# EAGLE design CONVEYOR-v2_0 (EAGLE 9.7.0)

## Sheet 1 of 2
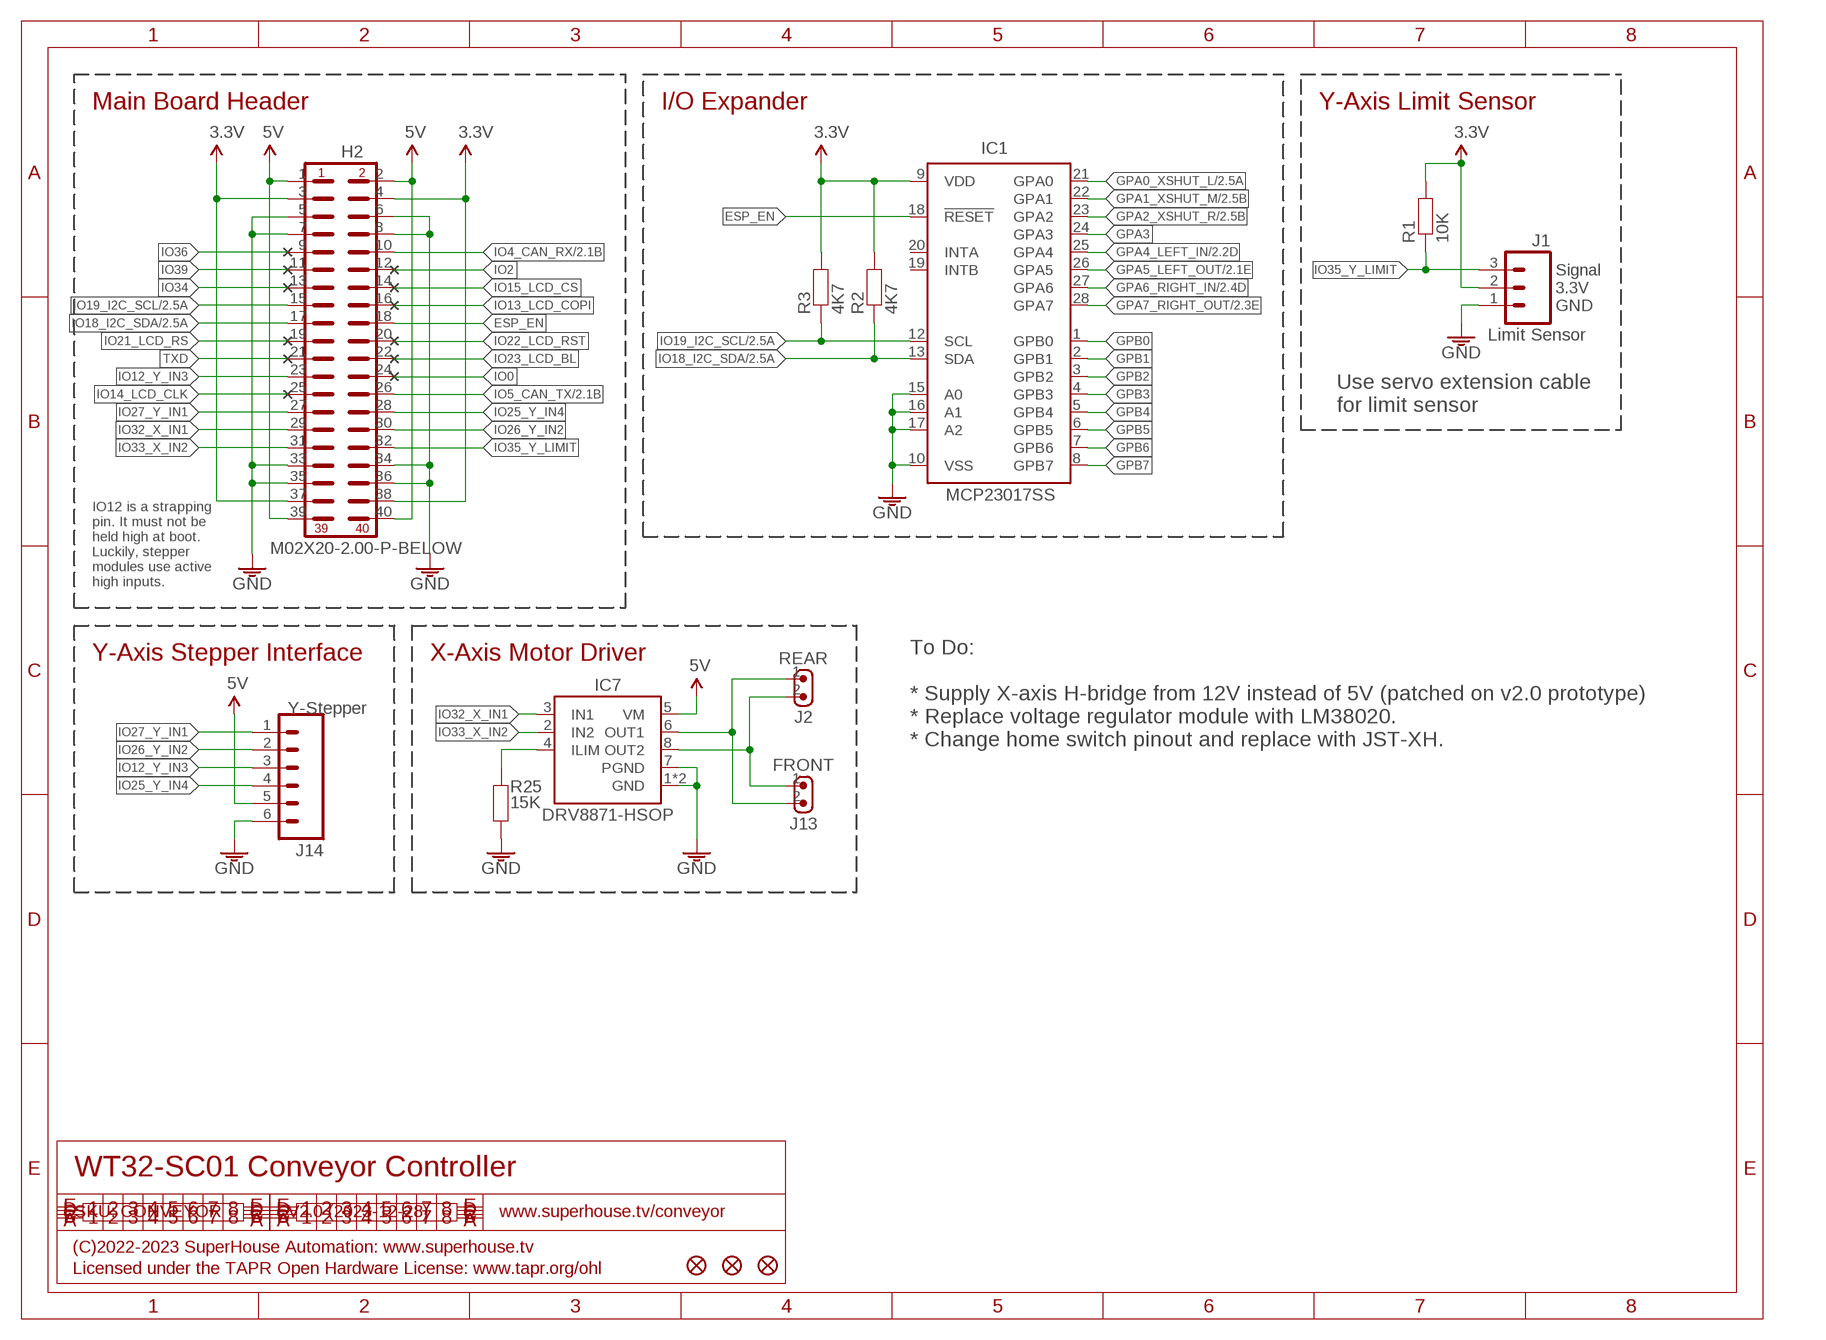
[diagram p0: schematic, sheet 1]

### Parts
H2  M02X20-2.00-P-BELOW  [2X20-2.00-P-BELOW]
IC1  MCP23017SS  [SSOP28]
IC7  DRV8871-HSOP  [SOIC8T]
J1  Limit Sensor  M03-PIN  [1X03-P]
J2  REAR  M02-B2B-XH  [JST-B2B-XH-A]
J13  FRONT  M02-B2B-XH  [JST-B2B-XH-A]
J14  Y-Stepper  M06-B6B-XH  [JST-B6B-XH-A]
R1  10K  RESISTOR0603  [R0603]
R2  4K7  RESISTOR0603  [R0603]
R3  4K7  RESISTOR0603  [R0603]
R25  15K  RESISTOR0603  [R0603]
U$4  FIDUCIAL1X2.5  [FIDUCIAL-1X2.5]
U$5  FIDUCIAL1X2.5  [FIDUCIAL-1X2.5]
U$6  FIDUCIAL1X2.5  [FIDUCIAL-1X2.5]

### Nets
3.3V: H2.3 H2.4 H2.37 H2.38 IC1.9(VDD) J1.2 R1.2 R2.2 R3.2 ; also sheet 2
5V: H2.1 H2.2 H2.39 H2.40 IC7.5(VM) J14.5 ; also sheet 2
ESP_EN: H2.18 IC1.18(!RESET)
GND: H2.5 H2.6 H2.7 H2.8 H2.33 H2.34 H2.35 H2.36 IC1.10(VSS) IC1.15(A0) IC1.16(A1) IC1.17(A2) IC7.1(GND) IC7.7(PGND) IC7.TGND(GND) J1.1 J14.6 R25.1 ; also sheet 2
GPA0_XSHUT_L: IC1.21(GPA0) ; also sheet 2
GPA1_XSHUT_M: IC1.22(GPA1) ; also sheet 2
GPA2_XSHUT_R: IC1.23(GPA2) ; also sheet 2
GPA3: IC1.24(GPA3)
GPA4_LEFT_IN: IC1.25(GPA4) ; also sheet 2
GPA5_LEFT_OUT: IC1.26(GPA5) ; also sheet 2
GPA6_RIGHT_IN: IC1.27(GPA6) ; also sheet 2
GPA7_RIGHT_OUT: IC1.28(GPA7) ; also sheet 2
GPB0: IC1.1(GPB0)
GPB1: IC1.2(GPB1)
GPB2: IC1.3(GPB2)
GPB3: IC1.4(GPB3)
GPB4: IC1.5(GPB4)
GPB5: IC1.6(GPB5)
GPB6: IC1.7(GPB6)
GPB7: IC1.8(GPB7)
IO0: H2.24
IO2: H2.12
IO4_CAN_RX: H2.10 ; also sheet 2
IO5_CAN_TX: H2.26 ; also sheet 2
IO12_Y_IN3: H2.23 J14.3
IO13_LCD_COPI: H2.16
IO14_LCD_CLK: H2.25
IO15_LCD_CS: H2.14
IO18_I2C_SDA: H2.17 IC1.13(SDA) R2.1 ; also sheet 2
IO19_I2C_SCL: H2.15 IC1.12(SCL) R3.1 ; also sheet 2
IO21_LCD_RS: H2.19
IO22_LCD_RST: H2.20
IO23_LCD_BL: H2.22
IO25_Y_IN4: H2.28 J14.4
IO26_Y_IN2: H2.30 J14.2
IO27_Y_IN1: H2.27 J14.1
IO32_X_IN1: H2.29 IC7.3(IN1)
IO33_X_IN2: H2.31 IC7.2(IN2)
IO34: H2.13
IO35_Y_LIMIT: H2.32 J1.3 R1.1
IO36: H2.9
IO39: H2.11
N$1: IC7.4(ILIM) R25.2
N$4: IC7.6(OUT1) J2.1 J13.2
N$5: IC7.8(OUT2) J2.2 J13.1
TXD: H2.21
Unconnected: IC1.19(INTB) IC1.20(INTA)

### Notes on the sheet
- Main Board Header | I/O Expander | Y-Axis Limit Sensor
- Signal
- 3.3V
- GND
- Use servo extension cable
  for limit sensor
- IO12 is a strapping
  pin. It must not be
  held high at boot.
  Luckily, stepper
  modules use active
  high inputs.
- Y-Axis Stepper Interface | X-Axis Motor Driver
- To Do:
  
  * Supply X-axis H-bridge from 12V instead of 5V (patched on v2.0 prototype)
  * Replace voltage regulator module with LM38020.
  * Change home switch pinout and replace with JST-XH.
- WT32-SC01 Conveyor Controller
- SKU: CONVEYOR | V2.0 (2023-12-28) | www.superhouse.tv/conveyor
- (C)2022-2023 SuperHouse Automation: www.superhouse.tv
- Licensed under the TAPR Open Hardware License: www.tapr.org/ohl

## Sheet 2 of 2
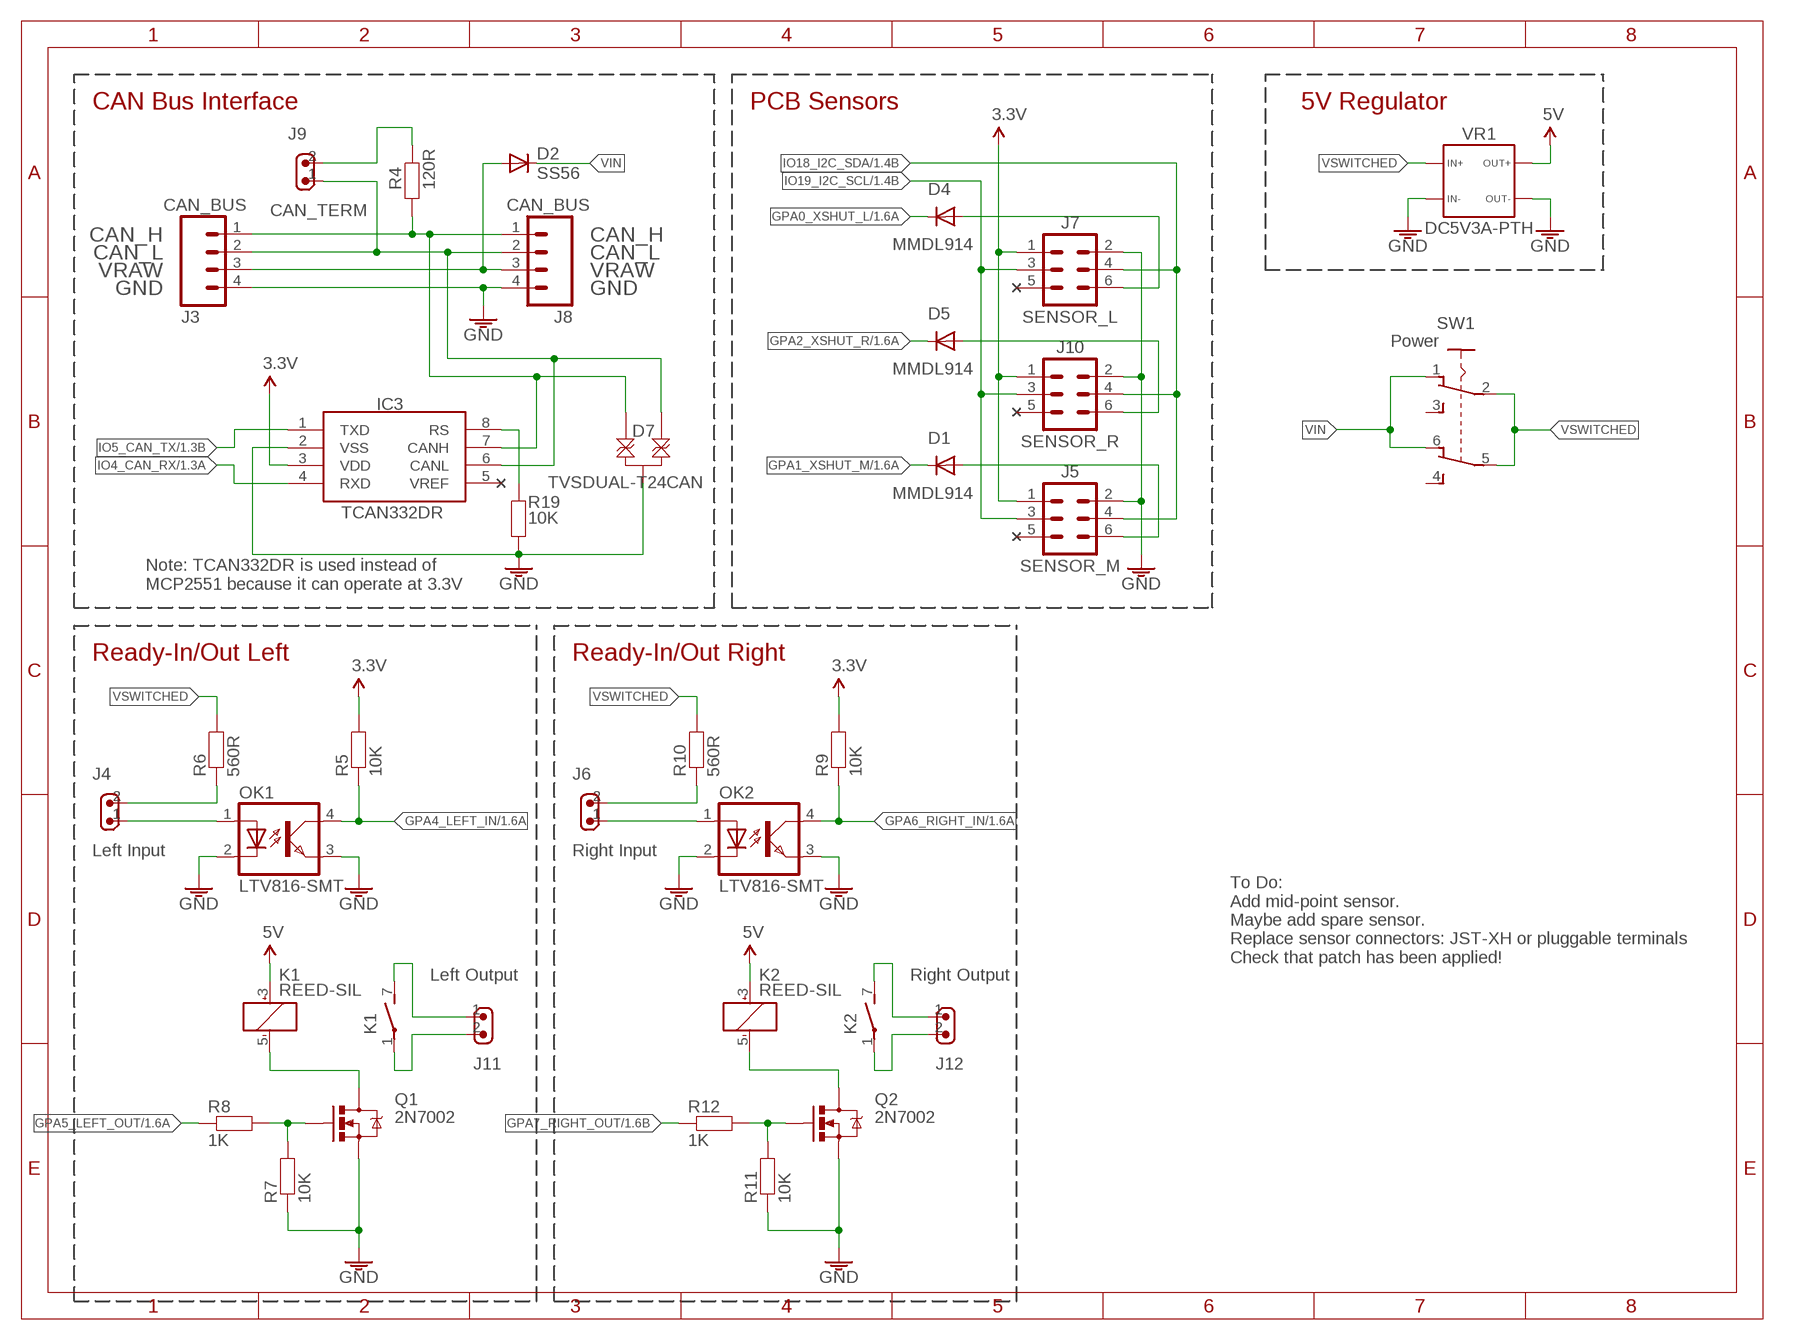
[diagram p1: schematic, sheet 2]

### Parts
D1  MMDL914  DIODESOD  [SOD-323]
D2  SS56  DIODESMA  [SMA-DIODE]
D4  MMDL914  DIODESOD  [SOD-323]
D5  MMDL914  DIODESOD  [SOD-323]
D7  TVSDUAL-T24CAN  [SOT23-3]
IC3  TCAN332DR  MCP2551  [SO08]
J3  CAN_BUS  M04-SCREW-3.81MM-VERT-PLUG  [SCREWTERMINAL-3.81MM-VERT-4]
J4  Left Input  M02-KF2510  [1X02-KF2510]
J5  SENSOR_M  M02X3-SHROUDED  [2X3-2.54-SHROUDED]
J6  Right Input  M02-KF2510  [1X02-KF2510]
J7  SENSOR_L  M02X3-SHROUDED  [2X3-2.54-SHROUDED]
J8  CAN_BUS  M04-SCREW-3.81MM-VERT-PLUG  [SCREWTERMINAL-3.81MM-VERT-4]
J9  CAN_TERM  M02-PIN-JUMP-Y  [1X02-P-JUMP-Y]
J10  SENSOR_R  M02X3-SHROUDED  [2X3-2.54-SHROUDED]
J11  Left Output  M02-KF2510  [1X02-KF2510]
J12  Right Output  M02-KF2510  [1X02-KF2510]
K1  REED-SIL  [REED]
K2  REED-SIL  [REED]
OK1  LTV816-SMT  [SMD4]
OK2  LTV816-SMT  [SMD4]
Q1  2N7002  MOSFET-NCHANNEL-233  [SOT23-3]
Q2  2N7002  MOSFET-NCHANNEL-233  [SOT23-3]
R4  120R  RESISTOR2010  [R2010]
R5  10K  RESISTOR0603  [R0603]
R6  560R  RESISTOR0603  [R0603]
R7  10K  RESISTOR0603  [R0603]
R8  1K  RESISTOR0603  [R0603]
R9  10K  RESISTOR0603  [R0603]
R10  560R  RESISTOR0603  [R0603]
R11  10K  RESISTOR0603  [R0603]
R12  1K  RESISTOR0603  [R0603]
R19  10K  RESISTOR0603  [R0603]
SW1  Power  SWITCH-DPDT3  [7201SD9AV2BE]
VR1  DC5V3A-PTH  [DC5V3A-PTH]

### Nets
3.3V: IC3.3(VDD) J5.1 J7.1 J10.1 R5.2 R9.2 ; also sheet 1
5V: K1.3(1:+) K2.3(1:+) VR1.3A VR1.3B ; also sheet 1
CAN_H1: D7.2 IC3.7(CANH) J3.1 J8.1 R4.1
CAN_L1: D7.1 IC3.6(CANL) J3.2 J8.2 J9.1
CAN_VIN: D2.A J3.3 J8.3
GND: D7.3 IC3.2(VSS) J3.4 J5.2 J7.2 J8.4 J10.2 OK1.2(C) OK1.3(EMIT) OK2.2(C) OK2.3(EMIT) Q1.2(S) Q2.2(S) R7.1 R11.1 R19.1 VR1.1A VR1.1B VR1.4A VR1.4B ; also sheet 1
GPA0_XSHUT_L: D4.1(C) ; also sheet 1
GPA1_XSHUT_M: D1.1(C) ; also sheet 1
GPA2_XSHUT_R: D5.1(C) ; also sheet 1
GPA4_LEFT_IN: OK1.4(COL) R5.1 ; also sheet 1
GPA5_LEFT_OUT: R8.1 ; also sheet 1
GPA6_RIGHT_IN: OK2.4(COL) R9.1 ; also sheet 1
GPA7_RIGHT_OUT: R12.1 ; also sheet 1
IO4_CAN_RX: IC3.4(RXD) ; also sheet 1
IO5_CAN_TX: IC3.1(TXD) ; also sheet 1
IO18_I2C_SDA: J5.4 J7.4 J10.4 ; also sheet 1
IO19_I2C_SCL: J5.3 J7.3 J10.3 ; also sheet 1
N$2: IC3.8(RS) R19.2
N$3: D1.2(A) J5.6
N$20: J9.2 R4.2
N$22: D5.2(A) J10.6
N$24: J4.1 OK1.1(A)
N$26: J4.2 R6.1
N$27: D4.2(A) J7.6
N$28: K1.5(1:-) Q1.3(D)
N$31: J11.2 K1.1(2:P)
N$32: Q1.1(G) R7.2 R8.2
N$34: J11.1 K1.7(2:S)
N$36: Q2.1(G) R11.2 R12.2
N$38: K2.5(1:-) Q2.3(D)
N$40: J12.2 K2.1(2:P)
N$41: J12.1 K2.7(2:S)
N$42: J6.1 OK2.1(A)
N$43: J6.2 R10.1
VIN: D2.C SW1.1 SW1.6
VSWITCHED: R6.2 R10.2 SW1.2 SW1.5 VR1.2A VR1.2B
Unconnected: IC3.5(VREF) J5.5 J7.5 J10.5 SW1.3 SW1.4

### Notes on the sheet
- CAN Bus Interface | PCB Sensors | 5V Regulator
- CAN_H | CAN_H
- CAN_L | CAN_L
- VRAW | VRAW
- GND | GND
- Note: TCAN332DR is used instead of
  MCP2551 because it can operate at 3.3V
- Ready-In/Out Left | Ready-In/Out Right
- To Do:
  Add mid-point sensor.
  Maybe add spare sensor.
  Replace sensor connectors: JST-XH or pluggable terminals
  Check that patch has been applied!

## Library data of the parts
D1 D2 D4 D5 = SuperHouse-Diodes:DIODE: Diode Standard reverse protection diodes and small signal diodes. SMA package can handle up to about 1A. SOD-323 can handle about 200mA.
D7 = SuperHouse-Diodes:TVSDUAL: Transient Voltage Suppressor (dual)
H2 = SuperHouse-Connectors:M02X20: M40 header in 2x20 format
IC1 = SuperHouse-ICs:MCP23017: http://ww1.microchip.com/downloads/en/DeviceDoc/21952a.pdf Source: http://ww1.microchip.com/downloads/en/DeviceDoc/21952a.pdf
IC3 = SuperHouse-ICs:MCP2551: CAN bus transceiver. Pin compatible chips with different specs include: MCP2551 (5V only) TCAN332DR (3.3V)
IC7 = SuperHouse-MotorDrivers:DRV8871: TI DRV8871 3.6A brushed DC motor driver
J1 = SuperHouse-Connectors:M03: 3-way header Standard 1x3 header, and screw terminal variations
J2 J4 J6 J9 J11-J13 = SuperHouse-Connectors:M02: 2-way header Standard 1x2 header, and screw terminal variations
J3 J8 = SuperHouse-Connectors:M04: 4-way header Standard 1x4 header, and screw terminal variations
J5 J7 J10 = SuperHouse-Connectors:M02X3: M6 header in 2x3 format
J14 = SuperHouse-Connectors:M06: 6-way header Standard 1x6 header, and screw terminal variations
K1 K2 = SuperHouse-Relays:REED: RELAY reed, 1 x norm. open with polarity, grid 5.08
OK1 OK2 = SuperHouse-LEDs:LTV816: OPTO COUPLER Source: LITEON, LTV816.pdf; OC_FARNELL: unknown; OC_NEWARK: unknown
Q1 Q2 = SuperHouse-Transistors:MOSFET-NCHANNEL: N-channel MOSFET
R1-R12 R19 R25 = SuperHouse-Resistors:RESISTOR: Resistors in both surface-mount and through-hole versions.
SW1 = SuperHouse-Switches:SWITCH-DPDT: DPDT toggle switch
U$4-U$6 = SuperHouse-Symbols:FIDUCIAL: Fiducial Alignment Points Various fiducial points for machine vision alignment.
VR1 = SuperHouse-Regulators:DC5V3A: 5V 3A voltage regulator module from AliExpress

## Board
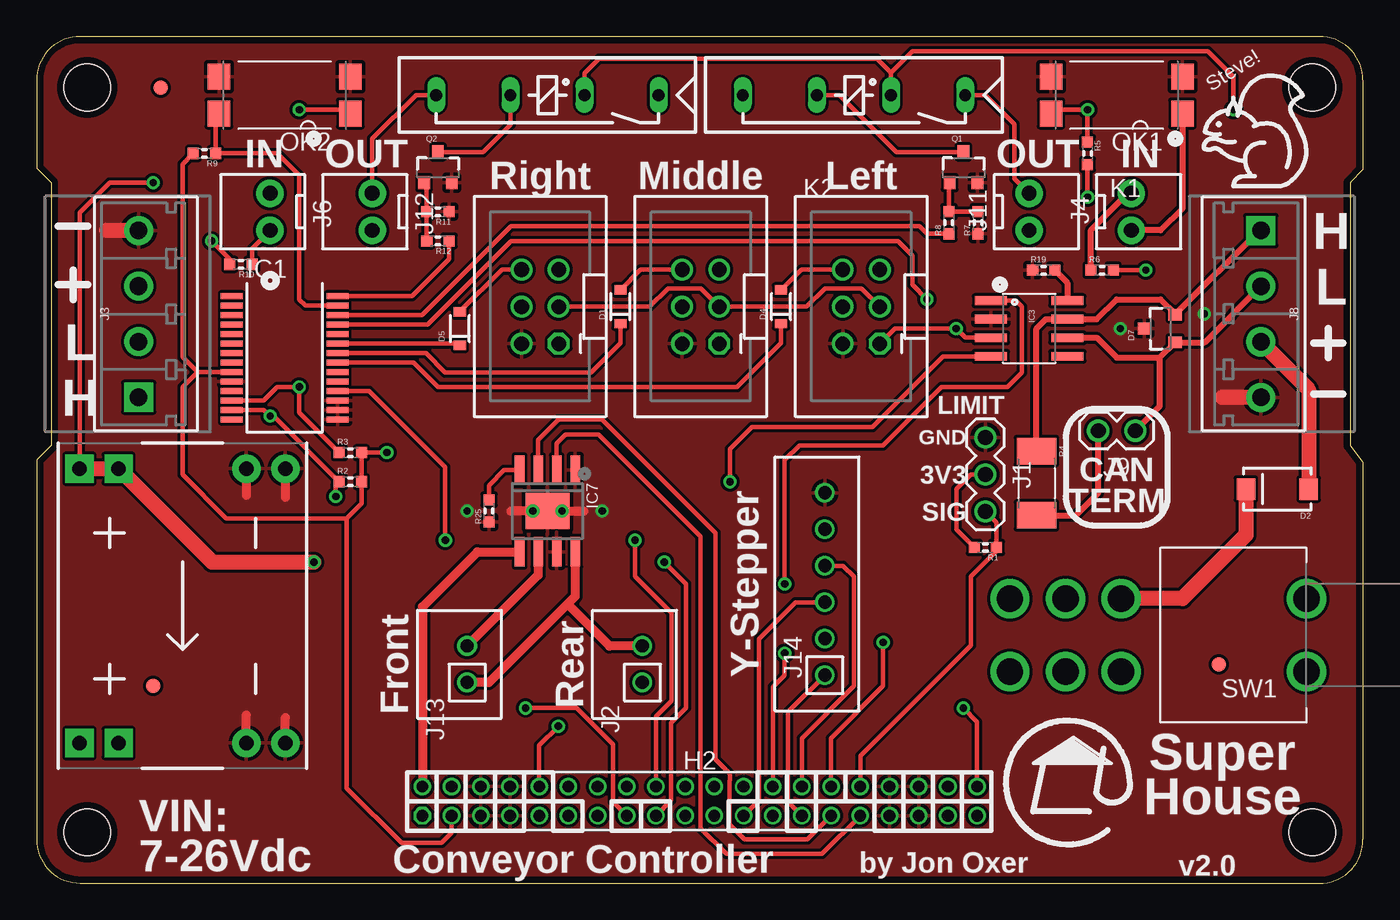
[diagram p2: board, top side]
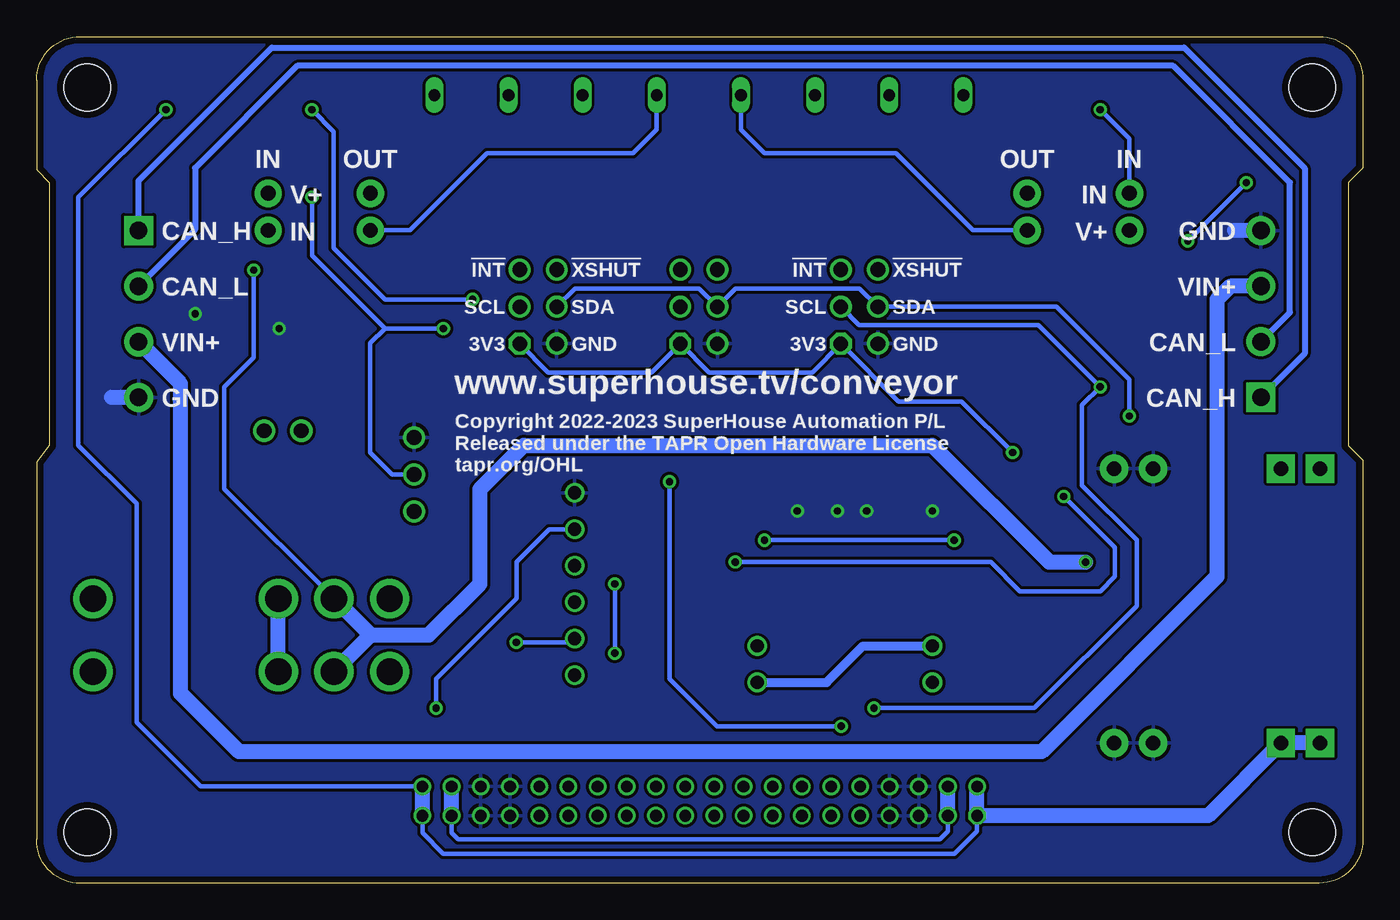
[diagram p3: board, bottom side, seen from below]

Size 90.87 x 58.01 mm. Coordinates in mm from the lower left corner, seen from the top.
Outline: 87.87,58.01 3,58.01 arc90 0,55.01 0,49 1,48 1,30 0,29 0,3 arc90 3,0 87.87,0 arc92 90.87,3 90.87,28.87 90,30 90,48 90.87,48.87 90.87,55.01 arc90 87.87,58.01
Copper layers (1*16): Top 0.035mm / dielectric 1.5mm / Bottom 0.035mm
Design rules "SuperHouse-Design-Rules *": minimum track width 10mil, minimum drill 24mil, track to track 8mil, track to pad 8mil, pad to pad 8mil, via to via 8mil, smd to smd 6mil, copper to edge 18mil, drill to drill 8mil, minimum pad ring 7mil, minimum via ring 8mil, stop-mask expansion 4mil, vias tented up to drill 0.5mm, thermal gap 10mil
Holes 3.2 mm at 3.47,54.52 3.47,3.49 87.4,54.52 87.4,3.49

### Footprints (pad centres in the part's own frame; a part is rotated, then mirrored left to right if it is on the bottom)
SOD-323 = smd 0.63 x 0.83: 1 -1.15,0; 2 1.15,0
SMA-DIODE = smd 1.27 x 1.47: A -2.15,0; C 2.15,0
SOT23-3 = smd 0.8 x 0.9: 1 -0.95,-1; 2 0.95,-1; 3 0,1.1
2X20-2.00-P-BELOW = drill 0.8 octagon: 1 -19,-1 | drill 0.8: 2 -19,1; 3 -17,-1; 4 -17,1; 5 -15,-1; 6 -15,1; 7 -13,-1; 8 -13,1; 9 -11,-1; 10 -11,1; 11 -9,-1; 12 -9,1; 13 -7,-1; 14 -7,1; 15 -5,-1; 16 -5,1; 17 -3,-1; 18 -3,1; 19 -1,-1; 20 -1,1; 21 1,-1; 22 1,1; 23 3,-1; 24 3,1; 25 5,-1; 26 5,1; 27 7,-1; 28 7,1; 29 9,-1; 30 9,1; 31 11,-1; 32 11,1; 33 13,-1; 34 13,1; 35 15,-1; 36 15,1; 37 17,-1; 38 17,1; 39 19,-1; 40 19,1
SSOP28 = smd 0.4 x 1.5: 1 -4.225,-3.625; 2 -3.575,-3.625; 3 -2.925,-3.625; 4 -2.275,-3.625; 5 -1.625,-3.625; 6 -0.975,-3.625; 7 -0.325,-3.625; 8 0.325,-3.625; 9 0.975,-3.625; 10 1.625,-3.625; 11 2.275,-3.625; 12 2.925,-3.625; 13 3.575,-3.625; 14 4.225,-3.625; 15 4.225,3.625; 16 3.575,3.625; 17 2.925,3.625; 18 2.275,3.625; 19 1.625,3.625; 20 0.975,3.625; 21 0.325,3.625; 22 -0.325,3.625; 23 -0.975,3.625; 24 -1.625,3.625; 25 -2.275,3.625; 26 -2.925,3.625; 27 -3.575,3.625; 28 -4.225,3.625
SO08 = smd 0.61 x 2.21: 1 -1.905,-2.616; 2 -0.635,-2.616; 3 0.635,-2.616; 4 1.905,-2.616; 5 1.905,2.616; 6 0.635,2.616; 7 -0.635,2.616; 8 -1.905,2.616
SOIC8T = smd 2.032 x 0.66: 1 -2.794,1.905; 2 -2.794,0.635; 3 -2.794,-0.635; 4 -2.794,-1.905; 5 2.794,-1.905; 6 2.794,-0.635; 7 2.794,0.635; 8 2.794,1.905 | smd 2.489 x 2.997: TGND 0,0
1X03-P = drill 1.016: 1 -2.54,0; 2 0,0; 3 2.54,0
JST-B2B-XH-A = drill 0.9: 1 -1.25,0; 2 1.25,0
SCREWTERMINAL-3.81MM-VERT-4 = drill 1.2 pad 2 square: 1 -5.715,0 | drill 1.2 pad 2: 2 -1.902,0; 3 1.908,0; 4 5.718,0
1X02-KF2510 = drill 1.016 pad 1.88: 1 -1.27,0; 2 1.27,0
2X3-2.54-SHROUDED = drill 1 octagon: 1 -2.54,-1.27 | drill 1: 2 -2.54,1.27; 3 0,-1.27; 4 0,1.27; 5 2.54,-1.27; 6 2.54,1.27
1X02-P-JUMP-Y = drill 1.016: 1 -1.27,0; 2 1.27,0
JST-B6B-XH-A = drill 0.9: 1 -6.25,0; 2 -3.75,0; 3 -1.25,0; 4 1.25,0; 5 3.75,0; 6 6.25,0
REED = drill 0.813 long: 1 -7.62,0; 3 -2.54,0; 5 2.54,0; 7 7.62,0
SMD4 = smd 1.78 x 1.55: 1 -1.27,-4.5; 2 1.27,-4.5; 3 1.27,4.5; 4 -1.27,4.5
R0603 = smd 0.762 x 0.762: 1 -0.762,0; 2 0.762,0
R2010 = smd 1.8 x 2.7: 1 -2.2,0; 2 2.2,0
7201SD9AV2BE = drill 1.8: 1 12.7,-2.5; 2 16.51,-2.5; 3 20.32,-2.5; 4 20.32,2.5; 5 16.51,2.5; 6 12.7,2.5; 7 0,2.5; 8 0,-2.5
FIDUCIAL-1X2.5 = smd 1 x 1: 1 0,0
DC5V3A-PTH = drill 1 pad 1.93: 1A -9.4,7.05; 1B -9.4,4.375; 4A 9.4,7.05; 4B 9.4,4.375 | drill 1 pad 1.93 square: 2A -9.4,-4.375; 2B -9.4,-7.05; 3A 9.4,-4.375; 3B 9.4,-7.05

### Placement (x,y rotation side)
D1  40,39.5 90 top
D2  85,27 180 top
D4  51,39.5 90 top
D5  29,38 90 top
D7  77,38 90 top
H2  45.44,5.62 0 top
IC1  17,36 270 top
IC3  68,38 270 top
IC7  35,25.5 270 top
J1  65,28 270 top
J2  41.5,15 90 top
J3  7,39 90 top
J4  75,46 90 top
J5  45.5,39.5 90 top
J6  16,46 270 top
J7  56.5,39.5 90 top
J8  83.87,39 270 top
J9  74,31 180 top
J10  34.5,39.5 90 top
J11  68,46 90 top
J12  23,46 270 top
J13  29.5,15 90 top
J14  54,20.5 90 top
K1  56,54 180 top
K2  35,54 180 top
OK1  74,54 90 top
OK2  17,54 90 top
Q1  63.5,49 0 top
Q2  27.5,49 0 top
R1  65,23 180 top
R2  21.5,27.5 0 top
R3  21.5,29.5 0 top
R4  68.5,27.4 270 top
R5  72,50 270 top
R6  73,42 0 top
R7  64.5,45.25 90 top
R8  62.5,45.25 90 top
R9  11.5,50 180 top
R10  14,42.4 180 top
R11  27.5,46 180 top
R12  27.5,44 180 top
R19  69,42 0 top
R25  31,25.5 90 top
SW1  87,17 180 top
U$4  8,13.5 0 top
U$5  81,15 0 top
U$6  8.5,54.5 0 top
VR1  10,19 270 top

### Tracks (layer width: path | path; a pad name or v marks a point on that pad's centre or on a via)
3.3V  (via drill 0.5)
  Top 0.305: 11.03,35.02 10,34 10,28 13,25 21.25,25 | 11.03,35.02 IC1.9 | 11.03,35.02 10,36.05 10,49.26 R9.2 | IC3.3 63.63,37.37 v63,38 58.81,38 J7.1 | R5.2 v72,47 | R1.2 63,24.24 63,27 64,28 J1.2 | 21.25,25 22.26,26.01 R2.2 R3.2 v24,29.5 | 21.25,25 21.25,6.5 25,2.75 27.75,2.75 28.43,3.44 H2.3
  Bottom 0.305: H2.3 28.43,3.56 29,3 62,3 62.44,3.44 H2.37 | 67,38 v63,38 | v72,47 72,43 67,38 | J1.2 66.5,28 68,29.5 68,37 67,38 | J7.1 55.81,35 48.73,35 J5.1 44.81,35 37.73,35 J10.1 31.81,33 27.5,33 v24,29.5
  Bottom 1.016: H2.3 H2.4 | H2.37 H2.38
5V  (via drill 0.5)
  Top 0.305: K2.3 37.54,55.5 38.54,56.5 57.58,56.5 58.54,55.54 | K1.3 58.54,55.54 | 58.54,55.54 60,57 80.25,57 82,55.25 v82,53 | H2.40 64.44,11.06 v63.5,12
  Top 0.61: IC7.5 30.21,22.71 26.43,18.93 H2.2
  Bottom 0.305: H2.39 64.44,3.44 63,2 28,2 26.43,3.56 H2.1 | H2.40 79.62,6.62 84,11 84,26 88,30 88,47 v82,53 | v63.5,12 63.5,14 58,19.5 58,22 55.75,24.25 J14.5
  Bottom 1.016: H2.39 H2.40 | VR1.3B VR1.3A 10.61,4.62 H2.1 H2.2
CAN_H1
  Top 0.406: D7.2 78.03,38.98 | 78.03,38.98 83.77,44.72 J8.1 | 78.03,38.98 77,40 74,40 72.64,38.63 IC3.7 69.14,38.63 68.5,38 R4.1
  Bottom 0.406: J8.1 83.87,48.13 74.75,57.25 12.25,57.25 4,49 4,36.28 J3.1
CAN_L1
  Top 0.406: J8.2 80.02,37.05 D7.1 76.95,36 | IC3.6 72.64,37.37 74,36 76.95,36 | J9.1 76.95,32.68 76.95,36
  Bottom 0.406: J3.2 5,39.1 5,48 13,56 73,56 80,49 80,44.77 J8.2
CAN_VIN
  Top 1.016: D2.A 87.15,33.81 J8.3
  Bottom 1.016: J3.3 9.09,40.91 10,40 10,21 22,9 77,9 81,13 81,34.22 J8.3
ESP_EN  (via drill 0.5)
  Top 0.305: H2.18 42.44,11.44 43.5,12.5 43.5,18.5 41,21 v41,23.5 | v28,23.5 28,28.5 22.77,33.73 IC1.18
  Bottom 0.305: v41,23.5 v28,23.5
GND  (via drill 0.5)
  Top 0.61: VR1.1B 14.38,26.57 | VR1.1A 17.05,26.45 | VR1.4B 14.38,11.53 | VR1.4A 17.05,11.35 | 37.5,25.5 IC7.TGND 32.5,25.5
  Top 1.016: J3.4 4.78,44.72 | J8.4 81.22,33.28
  Bottom 1.016: J3.4 8.78,44.72 | J8.4 85.72,33.28
  other vias: 74.25,38 80,39 36,25.5 34,25.5 38.75,25.5 29.5,25.5
  pour Bottom: 1,30.03 0.98,29.98 0,29 0,3 0.03,2.57 0.12,2.15 0.27,1.75 0.48,1.38 0.73,1.04 1.04,0.73 1.38,0.48 1.75,0.27 2.15,0.12 2.57,0.03 3,0 87.87,0 88.3,0.03 88.72,0.12 89.12,0.27 89.49,0.48 89.83,0.73 90.14,1.04 90.39,1.38 90.6,1.75 90.75,2.15 90.84,2.57 90.87,3 90.87,28.87 90.03,29.96 90.02,29.97 90.02,29.98 90.01,29.99 90.01,30 90,30.02 90,30.03 90,30.03 90,30.05 90,47.97 90.02,48.02 90.87,48.87 90.87,55.01 90.84,55.44 90.75,55.86 90.6,56.26 90.39,56.63 90.14,56.97 89.83,57.28 89.49,57.53 89.12,57.74 88.72,57.89 88.3,57.98 87.87,58.01 3,58.01 2.57,57.98 2.15,57.89 1.75,57.74 1.38,57.53 1.04,57.28 0.73,56.97 0.48,56.63 0.27,56.26 0.12,55.86 0.03,55.44 0,55.01 0,49 0.98,48.02 1,47.97
  pour Top: 1,30.03 0.98,29.98 0,29 0,3 0.03,2.57 0.12,2.15 0.27,1.75 0.48,1.38 0.73,1.04 1.04,0.73 1.38,0.48 1.75,0.27 2.15,0.12 2.57,0.03 3,0 87.87,0 88.3,0.03 88.72,0.12 89.12,0.27 89.49,0.48 89.83,0.73 90.14,1.04 90.39,1.38 90.6,1.75 90.75,2.15 90.84,2.57 90.87,3 90.87,28.87 90.03,29.96 90.02,29.97 90.02,29.98 90.01,29.99 90.01,30 90,30.02 90,30.03 90,30.03 90,30.05 90,47.97 90.02,48.02 90.87,48.87 90.87,55.01 90.84,55.44 90.75,55.86 90.6,56.26 90.39,56.63 90.14,56.97 89.83,57.28 89.49,57.53 89.12,57.74 88.72,57.89 88.3,57.98 87.87,58.01 3,58.01 2.57,57.98 2.15,57.89 1.75,57.74 1.38,57.53 1.04,57.28 0.73,56.97 0.48,56.63 0.27,56.26 0.12,55.86 0.03,55.44 0,55.01 0,49 0.98,48.02 1,47.97
GPA0_XSHUT_L
  Top 0.305: D4.1 51,37 48,34 27.5,34 25.82,35.67 IC1.21
GPA1_XSHUT_M
  Top 0.305: D1.1 40,37 38,35 28,35 26.68,36.33 IC1.22
GPA2_XSHUT_R
  Top 0.305: IC1.23 28.88,36.98 D5.1
GPA4_LEFT_IN  (via drill 0.5)
  Top 0.305: R5.1 v72,53 69.77,53 OK1.4 | IC1.25 26.77,38.27 32.5,44 59,44 60,43 60,41 v61,40
  Bottom 0.305: v72,53 70.5,51.5 70.5,43.5 67,40 v61,40
GPA5_LEFT_OUT
  Top 0.305: IC1.26 26.43,38.92 32.5,45 60.49,45 61,44.49 R8.1
GPA6_RIGHT_IN
  Top 0.305: IC1.27 18.43,39.58 18,40 18,48.5 16.5,50 R9.1 12.26,52.49 OK2.4
GPA7_RIGHT_OUT
  Top 0.305: IC1.28 25.73,40.23 28.26,42.76 R12.1
IO4_CAN_RX  (via drill 0.5)
  Top 0.305: IC3.4 62.09,36.09 57.25,31.25 49,31.25 47.5,29.75 v47.5,27.5 | H2.10 34.44,9.44 v35.75,10.75
  Bottom 0.305: v35.75,10.75 44.25,10.75 47.5,14 v47.5,27.5
IO5_CAN_TX  (via drill 0.5)
  Top 0.305: IC3.1 67.09,39.91 67.5,39.5 67.5,35 66.5,34 62,34 58,30 52.25,30 51.25,29 v51.25,20.5 | H2.26 50.44,13.44 51.25,14.25 v51.25,15.75
  Bottom 0.305: v51.25,15.75 v51.25,20.5
IO12_Y_IN3
  Top 0.305: J14.3 52,19.25 49.48,16.73 49.48,5.66 H2.23
IO18_I2C_SDA  (via drill 0.5)
  Top 0.305: IC1.13 15.57,32.42 v16,32 16.24,32 R2.1 20.5,27.26 v20.5,26.5 | H2.17 43.48,5.66 43.48,10.98 44.5,12 44.5,20.5 v43,22
  Bottom 0.305: v16,32 16,34.5 21,39.5 J10.4 34.48,40.75 42.98,40.75 J5.4 45.48,40.75 53.98,40.75 J7.4 | v43,22 25.5,22 23.5,20 18,20 17,21 17,23 v20.5,26.5
IO19_I2C_SCL  (via drill 0.5)
  Top 0.305: IC1.12 15.57,33.08 16.5,34 v18,34 18,32.24 R3.1 | H2.15 39.48,5.58 39.48,9.52 37,12 v33.5,12 | J7.3 56.52,40.75 54,40.75 52.75,39.5 J5.3 45.52,40.75 43.25,40.75 42,39.5 J10.3
  Bottom 0.305: J10.3 34.52,38.25 22.25,38.25 v18,34 19.25,32.75 19.25,27.25 15.5,23.5 15.5,19 22.5,12 v33.5,12
IO25_Y_IN4
  Top 0.305: H2.28 52.44,9.94 56,13.5 56,21 55.25,21.75 J14.4
IO26_Y_IN2  (via drill 0.5)
  Top 0.305: H2.30 54.44,9.94 58,13.5 v58,16.5
  Bottom 0.305: v58,16.5 54.25,16.5 J14.2
IO27_Y_IN1
  Top 0.305: H2.27 51.48,5.58 51.48,11.73 J14.1
IO32_X_IN1
  Top 0.305: H2.29 52.81,3 48.5,3 47.48,4.02 47.48,7.02 47.5,7.04 47.5,7.5 46.5,8.5 46.5,24 38.75,31.75 35.75,31.75 34.37,30.36 IC7.3
IO33_X_IN2
  Top 0.305: H2.31 53.81,2 47.25,2 45.48,3.77 45.48,23.77 38.5,30.75 36.25,30.75 35.63,30.14 IC7.2
IO35_Y_LIMIT
  Top 0.305: H2.32 56.44,8.73 64,16.3 64,21 65.76,22.76 R1.1 65.76,24.7 J1.3
N$1
  Top 0.305: R25.2 31,27.26 32.03,28.29 IC7.4
N$2
  Top 0.406: R19.2 70.62,41.15 IC3.8
N$3
  Top 0.305: J5.6 41.39,42.04 D1.2
N$4
  Top 0.61: IC7.6 34.37,21.11 J13.2
  Bottom 0.61: J2.1 36.75,13.75 34.25,16.25 J13.2
N$5
  Top 0.61: 36.38,19.12 36.91,19.66 IC7.8 | 36.38,19.12 31,13.75 J13.1 | J2.2 39.25,16.25 36.38,19.12
N$20
  Top 0.406: R4.2 71.2,25.2 72.73,26.73 J9.2
N$22
  Top 0.305: J10.6 31.89,42.04 D5.2
N$24
  Top 0.406: J4.1 77,44.73 78.5,46.23 OK1.1
N$26
  Top 0.406: R6.1 72.24,44.76 74.75,47.27 J4.2
N$27
  Top 0.305: J7.6 52.39,42.04 D4.2
N$28
  Top 0.305: Q1.3 58.9,50.1 55,54 K1.5
N$31
  Top 0.305: J11.2 67,48.27 67,52 65,54 K1.1
N$32
  Top 0.305: R7.2 R8.2 62.5,47.95 Q1.1
N$34
  Bottom 0.305: J11.1 65.27,44.73 60,50 50,50 48.38,51.62 K1.7
N$36
  Top 0.305: R12.2 R11.2 26.74,47.81 Q2.1
N$38
  Top 0.305: Q2.3 30.6,50.1 32.46,51.96 K2.5
N$40
  Bottom 0.305: J12.2 26.73,44.73 32,50 41,50 42.62,51.62 K2.1
N$41
  Top 0.305: J12.1 23,51 26,54 K2.7
N$42  (via drill 0.5)
  Top 0.305: v18,53 21.23,53 OK2.1
  Bottom 0.305: J6.1 16,51 v18,53
N$43
  Top 0.305: R10.1 14.76,43.49 J6.2
VIN
  Top 1.016: D2.C 82.85,23.85 78.5,19.5 SW1.1
  Bottom 1.016: SW1.6 SW1.1
VSWITCHED  (via drill 0.5)
  Top 0.305: R6.2 v76,42 | v8,48 5,48 2.95,45.95 VR1.2B | R10.2 13.24,42.76 v12,44
  Top 1.016: VR1.2B VR1.2A 12.03,22 v19,22
  Bottom 0.305: v76,42 76,36 78,34 78,27.01 SW1.2 | v12,44 v8,48
  Bottom 1.016: SW1.5 67.99,17 | 67.99,17 64,17 60.5,20.5 60.5,27 57.5,30 29.5,30 21.5,22 v19,22 | SW1.2 67.99,17

### Text on the board
tPlace: Steve! | IN | OUT | OUT | IN | Right | Middle | Left | H | L | L | H | LIMIT | GND | 3V3 | CAN / TERM | SIG | Y-Stepper | Front | Rear | Super / House | VIN: / 7-26Vdc | Conveyor Controller | by Jon Oxer | v2.0
bPlace: IN | OUT | OUT | IN | IN | V+ | GND | V+ | IN | CAN_H | !XSHUT | !INT | !XSHUT | !INT | VIN+ | CAN_L | SDA | SCL | SDA | SCL | CAN_L | GND | 3V3 | GND | 3V3 | VIN+ | www.superhouse.tv/conveyor | CAN_H | GND | Copyright 2022-2023 SuperHouse Automation P/L / Released under the TAPR Open Hardware License / tapr.org/OHL